# Altium project UG-003 Rev 3.PrjPcb (part 3 of 5)

## Sheet Sense Clock Ckt.SchDoc: Sense Clock Ckt
size OrCAD A; Engineer: Jack Walker; DocumentNumber: LM-003; Revision: 3; SheetNumber: 3; SheetTotal: 11
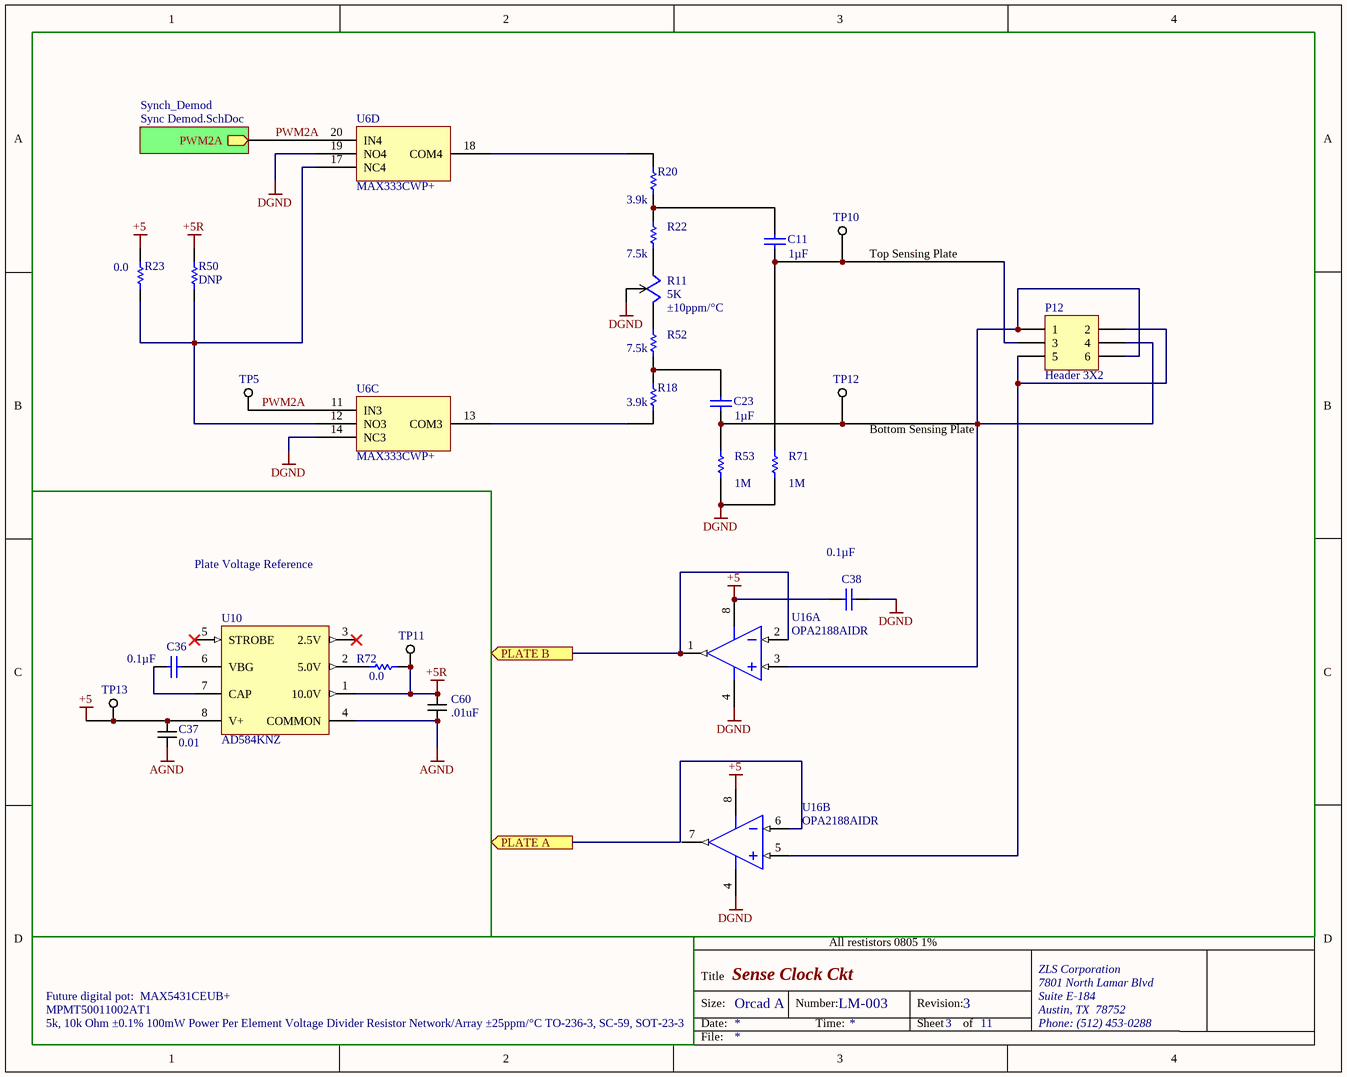
[diagram p2: Sense Clock Ckt.SchDoc]

### Parts
(Parts that share a designator on the sheet are numbered #1, #2 ... from top to bottom, then left to right.)
C11#2  Capacitance: 1µF  [CAPC0805(2012)155_L]  (hidden comment: CAP CER 1UF 25V X7R 0805)
C23  Capacitance: 1µF  [CAPC0805(2012)155_L]  (hidden comment: CAP CER 1UF 25V X7R 0805)
C36#1  Capacitance: 0.1µF  [CAPC0805(2012)100_N]  (hidden comment: CAP 100nF 25V 0805(2012))
C37#1  0.01  [RAD-0.1]
C38#1  Capacitance: 0.1µF  [CAPC0805(2012)155_L]  (hidden comment: CAP CER 0.1UF 25V X7R 0805)
C60  .01uF
P12#1  Header 3X2
R11  5K  Temperature Coefficient: ±10ppm/°C
R18  Resistance (Ohms): 3.9k  [RESC0805(2012)_N]  (hidden comment: RES SMD 3.9K OHM 5% 1/8W 0805)
R20  Resistance (Ohms): 3.9k  [RESC0805(2012)_N]  (hidden comment: RES SMD 3.9K OHM 5% 1/8W 0805)
R22  Resistance (Ohms): 7.5k  [RESC0805(2012)_N]  (hidden comment: RES SMD 7.5K OHM 1% 1/8W 0805)
R23  Resistance (Ohms): 0.0  [RESC0805(2012)_M]  (hidden comment: RES SMD 0.0 OHM JUMPER 1/8W 0805)
R50#1  DNP  [RESC0805(2012)_M]
R52#1  Resistance (Ohms): 7.5k  [RESC0805(2012)_N]  (hidden comment: RES SMD 7.5K OHM 1% 1/8W 0805)
R53#1  Resistance (Ohms): 1M  [RESC0805(2012)_N]  (hidden comment: RES SMD 1M OHM 1% 1/8W 0805)
R71  Resistance (Ohms): 1M  [RESC0805(2012)_N]  (hidden comment: RES SMD 1M OHM 1% 1/8W 0805)
R72  Resistance (Ohms): 0.0  [RESC0805(2012)_M]  (hidden comment: RES SMD 0.0 OHM JUMPER 1/8W 0805)
TP5  (no value)
TP10  (no value)
TP11  (no value)  [TESTPOINT .45]
TP12  (no value)
TP13  (no value)  [TESTPOINT .45]
U6#2  MAX333CWP+  (parts C,D of 4)
U10  AD584KNZ  [ADI-N-8]
U16#2  OPA2188AIDR  [D0008A_L]  (parts A,B of 2)

### Blocks framed on the sheet
Plate Voltage Reference: C36#1 C37#1 C60 R72 TP11 TP13 U10

### Sub-sheets
Synch_Demod = Sync Demod.SchDoc: PWM2A (out)

### Ports
PLATE A (out), PLATE B (out)

### Nets
+5: C37#1.1 C38#1.1 R23.2 TP13.1 U10.8(V+) U16#2.8(V+)
+5R: C60.1 R50#1.2 R72.1 TP11.1 U10.1(10.0V)
AGND: C37#1.2 C60.2 U10.4(COMMON)
DGND: C38#1.2 R11.3 R53#1.1 R71.1 U6#2.14(NC3) U6#2.19(NO4) U16#2.4(V-)
PWM2A: TP5.1 U6#2.11(IN3) U6#2.20(IN4) ; sheet Synch_Demod/PWM2A
NetC11#2_1: C11#2.1 P12#1.3 R71.2 TP10.1
NetC11#2_2: C11#2.2 R20.1 R22.2
NetC23_1: C23.1 P12#1.1 P12#1.4 P12#1.6 R53#1.2 TP12.1 U16#2.3(IN_A+)
NetC23_2: C23.2 R18.2 R52#1.1
NetC36#1_1: C36#1.1 U10.7(CAP)
NetC36#1_2: C36#1.2 U10.6(VBG)
NetP12#1_2: P12#1.2 P12#1.5 U16#2.5(IN_B+)
NetR11_1: R11.1 R22.1
NetR11_2: R11.2 R52#1.2
NetR18_1: R18.1 U6#2.13(COM3)
NetR20_2: R20.2 U6#2.18(COM4)
NetR23_1: R23.1 R50#1.1 U6#2.12(NO3) U6#2.17(NC4)
NetR72_2: R72.2 U10.2(5.0V)
NetU16#2_1: U16#2.1(OUT_A) U16#2.2(IN_A-) ; port PLATE B
NetU16#2_6: U16#2.6(IN_B-) ; port PLATE A

Not connected (* = marked no-connect by the designer): U6#2 15(N/C); U10 3(2.5V)* 5(STROBE)*; U16#2 7(OUT_B)

### Notes on the sheet
- (near TP10) Top Sensing Plate
- (near TP12) Bottom Sensing Plate
- All restistors 0805 1%
- MPMT50011002AT1
- 5k, 10k Ohm ±0.1% 100mW Power Per Element Voltage Divider Resistor Network/Array ±25ppm/°C TO-236-3, SC-59, SOT-23-3
- Future digital pot:  MAX5431CEUB+
- Title
- Size:
- Date:
- Orcad A
- Number:
- Time:
- Revision:
- Sheet
- of
- ZLS Corporation
- 7801 North Lamar Blvd
- Suite E-184
- Austin, TX  78752
- Phone: (512) 453-0288
- File:

### Library data of the parts
C11#2 C23 = CMP-1036-04882-1: Manufacturer: Murata Electronics North America; Manufacturer Part Number: GRM21BR71E105KA99L; Tolerance: ±10%; Supplier 1: Digi-Key; Supplier Part Number 1: 490-6484-6-ND; RoHS: RoHS Compliant; Description: CAP CER 1UF 25V X7R 0805; Category: Capacitors; Stock 1: 295074; Pricing 1: 1=0.14, 10=0.099, 100=0.0468, 500=0.0328, 1000=0.02715 (USD); Packaging: Digi-Reel®; Part Status: Active; Voltage - Rated: 25V; Temperature Coefficient: X7R; Operating Temperature: -55°C ~ 125°C; Features: -; Ratings: -; Applications: General Purpose; Mounting Type: Surface Mount, MLCC; Package / Case: 0805 (2012 Metric); Size / Dimension: 0.079" L x 0.049" W (2.00mm x 1.25mm); Height - Seated (Max): -; Thickness (Max): 0.053" (1.35mm); Lead Spacing: -; Lead Style: -; ComponentLink1URL: http://www.murata.com/~/media/webrenewal/support/library/catalog/products/capacitor/mlcc/c02e.ashx; ComponentLink1Description: http://www.murata.com/~/media/webrenewal/support/library/catalog/products/capacitor/mlcc/c02e.ashx
C36#1 = CMP-1036-04416-1: CAP 100nF 25V -20% to +80% 0805 (2012 Metric) Thickness 1mm SMD; Manufacturer: Murata Electronics North America; Manufacturer Part Number: GRM21BR71E104KA01L; Tolerance: ±10%; Temperature Coefficient: X7R; Supplier 1: Digi-Key; Supplier Part Number 1: 490-1673-1-ND; RoHS: RoHS Compliant; Category: Capacitors; Stock 1: 895391; Pricing 1: 1=0.2, 10=0.145, 100=0.0683, 500=0.04788, 1000=0.03964 (USD); Packaging: Cut Tape (CT); Part Status: Active; Voltage - Rated: 25V; Operating Temperature: -55°C ~ 125°C; Features: -; Ratings: -; Applications: General Purpose; Mounting Type: Surface Mount, MLCC; Package / Case: 0805 (2012 Metric); Size / Dimension: 0.079" L x 0.049" W (2.00mm x 1.25mm); Height - Seated (Max): -; Thickness (Max): 0.053" (1.35mm); Lead Spacing: -; Lead Style: -; ComponentLink1URL: http://www.murata.com/~/media/webrenewal/support/library/catalog/products/capacitor/mlcc/c02e.ashx; ComponentLink1Description: http://www.murata.com/~/media/webrenewal/support/library/catalog/products/capacitor/mlcc/c02e.ashx
C37#1 = CAP B: CAP CER 10000PF 50V 10% X7R 0402; Manufacturer 1: Murata Electronics North America; Manufacturer Part Number 1: GRM155R71H103KA88D; Category 1: Capacitors; Supplier 1: Digi-Key; Supplier Part Number 1: 490-4516-2-ND; RoHS 1: RoHS Compliant; Description 1: CAP CER 10000PF 50V 10% X7R 0402; Stock 1: 652600; Pricing 1: 10000=0.00372, 20000=0.00354, 30000=0.00336, 50000=0.00301, 100000=0.00243 (USD); Packaging: Tape & Reel (TR); Capacitance: 10000pF; Tolerance: ±10%; Voltage - Rated: 50V; Temperature Coefficient: X7R; Mounting Type: Surface Mount, MLCC; Operating Temperature: -55°C ~ 125°C; Applications: General Purpose; Ratings: -; Package / Case: 0402 (1005 Metric); Size / Dimension: 0.039" L x 0.020" W (1.00mm x 0.50mm); Height - Seated (Max): -; Thickness (Max): 0.022" (0.55mm); Lead Spacing: -; Features: -; Lead Style: -; ComponentLink1URL: http://www.murata.com/products/catalog/pdf/c02e.pdf; ComponentLink1Description: http://www.murata.com/products/catalog/pdf/c02e.pdf
C38#1 = CMP-1036-04882-1: Manufacturer: Murata Electronics North America; Manufacturer Part Number: GRM21BR71E104KA01L; Tolerance: ±10%; Supplier 1: Digi-Key; Supplier Part Number 1: 490-1673-6-ND; RoHS: RoHS Compliant; Description: CAP CER 0.1UF 25V X7R 0805; Category: Capacitors; Stock 1: 891652; Pricing 1: 1=0.2, 10=0.145, 100=0.0683, 500=0.04788, 1000=0.03964 (USD); Packaging: Digi-Reel®; Part Status: Active; Voltage - Rated: 25V; Temperature Coefficient: X7R; Operating Temperature: -55°C ~ 125°C; Features: -; Ratings: -; Applications: General Purpose; Mounting Type: Surface Mount, MLCC; Package / Case: 0805 (2012 Metric); Size / Dimension: 0.079" L x 0.049" W (2.00mm x 1.25mm); Height - Seated (Max): -; Thickness (Max): 0.053" (1.35mm); Lead Spacing: -; Lead Style: -; ComponentLink1URL: http://www.murata.com/~/media/webrenewal/support/library/catalog/products/capacitor/mlcc/c02e.ashx; ComponentLink1Description: http://www.murata.com/~/media/webrenewal/support/library/catalog/products/capacitor/mlcc/c02e.ashx
C60 = CAP B: CAP CER 10000PF 50V X7R 0805; Manufacturer 1: Murata Electronics North America; Manufacturer Part Number 1: GRM216R71H103KA01D; Category 1: Capacitors; Tolerance: ±10%; Supplier 1: Digi-Key; Supplier Part Number 1: 490-1664-1-ND; RoHS 1: RoHS Compliant; Description 1: CAP CER 10000PF 50V X7R 0805; Stock 1: 1003025; Pricing 1: 1=0.1, 10=0.072, 25=0.052, 50=0.0392, 100=0.032, 250=0.02672, 500=0.02282, 1000=0.01793 (USD); Packaging: Cut Tape (CT); Part Status: Active; Capacitance: 10000pF; Voltage - Rated: 50V; Temperature Coefficient: X7R; Operating Temperature: -55°C ~ 125°C; Features: -; Ratings: -; Applications: General Purpose; Mounting Type: Surface Mount, MLCC; Package / Case: 0805 (2012 Metric); Size / Dimension: 0.079" L x 0.049" W (2.00mm x 1.25mm); Height - Seated (Max): -; Thickness (Max): 0.028" (0.70mm); Lead Spacing: -; Lead Style: -; ComponentLink1URL: http://www.murata.com/~/media/webrenewal/support/library/catalog/products/capacitor/mlcc/c02e.ashx; ComponentLink1Description: http://www.murata.com/~/media/webrenewal/support/library/catalog/products/capacitor/mlcc/c02e.ashx
P12#1 = Header 3X2: Header, 3-Pin, Dual row; Manufacturer 1: Amphenol FCI; Manufacturer Part Number 1: 861400062YO2LF; Description 1: HEADER BERGSTIK; Category 1: Connectors, Interconnects; Pitch - Mating: 0.100" (2.54mm); Style: Board to Board or Cable; Shrouding: Unshrouded; Number of Positions: 6; Number of Positions Loaded: All; Contact Length - Mating: 0.276" (7.00mm); Contact Length - Post: 0.118" (3.00mm); Overall Contact Length: 0.496" (12.60mm); Material Flammability Rating: UL94 V-0; Current Rating: 3A; Voltage Rating: 1000V; Supplier 1: Digi-Key; Supplier Part Number 1: 861400062YO2LF-ND; RoHS 1: RoHS Compliant; Stock 1: 0; Pricing 1: 6000=0.09952 (USD); Packaging: Bulk; Part Status: Active; Connector Type: Header; Contact Type: Male Pin; Number of Rows: 2; Row Spacing - Mating: 0.100" (2.54mm); Mounting Type: Through Hole; Termination: Solder; Fastening Type: -; Insulation Height: 0.102" (2.60mm); Contact Shape: Square; Contact Finish - Mating: Gold or Gold, GXT™; Contact Finish Thickness - Mating: 8µin (0.20µm); Contact Finish - Post: -; Contact Material: Copper Alloy; Insulation Material: Thermoplastic; Features: -; Operating Temperature: -55°C ~ 125°C; Ingress Protection: -; Insulation Color: -; Mated Stacking Heights: -; Contact Finish Thickness - Post: -; Applications: -; ComponentLink1URL: http://portal.fciconnect.com/Comergent//fci/drawing/c-8614-0086.pdf; ComponentLink1Description: http://portal.fciconnect.com/Comergent//fci/drawing/c-8614-0086.pdf
R11 = RES1, CENTER TAP: TRIMMER 5K OHM 0.25W PC PIN; Manufacturer 1: Vishay Foil Resistors (Division of Vishay Precision Group); Manufacturer Part Number 1: Y00535K00000J0L; Category 1: Potentiometers, Variable Resistors; Power (Watts): 0.25W, 1/4W; Tolerance: ±5%; Number of Turns: 21; Adjustment Type: Side Adjustment; Resistive Material: Metal Foil; Supplier 1: Digi-Key; Supplier Part Number 1: 804-1020-ND; RoHS 1: RoHS Compliant; Description 1: TRIMMER 5K OHM 0.25W PC PIN; Stock 1: 679; Pricing 1: 1=34.42, 10=32.265, 25=26.5292, 50=22.944, 100=22.227, 250=20.793, 500=19.2156 (USD); Packaging: Bulk; Part Status: Active; Resistance (Ohms): 5k; Mounting Type: Through Hole; Termination Style: PC Pins; Size / Dimension: Rectangular - 0.250" x 0.175" Face x 0.250" L (6.35mm x 4.45mm x 6.35mm); ComponentLink1URL: http://www.vishaypg.com/docs/63053/1240.pdf; ComponentLink1Description: http://www.vishaypg.com/docs/63053/1240.pdf
R18 R20 = CMP-1013-00606-1: Manufacturer: Vishay Dale; Manufacturer Part Number: CRCW08053K90JNEA; Power (Watts): 0.125W, 1/8W; Temperature Coefficient: ±200ppm/°C; Supplier 1: Digi-Key; Supplier Part Number 1: 541-3.9KADKR-ND; RoHS: RoHS Compliant; Description: RES SMD 3.9K OHM 5% 1/8W 0805; Category: Resistors; Stock 1: 20963; Pricing 1: 1=0.1, 10=0.028, 100=0.0114, 1000=0.00513, 2500=0.00445 (USD); Packaging: Digi-Reel®; Part Status: Active; Tolerance: ±5%; Composition: Thick Film; Features: Automotive AEC-Q200; Operating Temperature: -55°C ~ 155°C; Package / Case: 0805 (2012 Metric); Supplier Device Package: 0805; Size / Dimension: 0.079" L x 0.049" W (2.00mm x 1.25mm); Height - Seated (Max): 0.020" (0.50mm); Failure Rate: -; ComponentLink1URL: http://www.vishay.com/docs/20035/dcrcwe3.pdf; ComponentLink1Description: http://www.vishay.com/docs/20035/dcrcwe3.pdf
R22 R52#1 = CMP-1013-00606-1: Manufacturer: Vishay Dale; Manufacturer Part Number: CRCW08057K50FKEA; Power (Watts): 0.125W, 1/8W; Temperature Coefficient: ±100ppm/°C; Supplier 1: Digi-Key; Supplier Part Number 1: 541-7.50KCDKR-ND; RoHS: RoHS Compliant; Category: Resistors; Stock 1: 0; Pricing 1: 1=0.1, 10=0.044, 100=0.0178, 1000=0.00802, 2500=0.00696 (USD); Packaging: Digi-Reel®; Part Status: Active; Tolerance: ±1%; Composition: Thick Film; Features: Automotive AEC-Q200; Operating Temperature: -55°C ~ 155°C; Package / Case: 0805 (2012 Metric); Supplier Device Package: 0805; Size / Dimension: 0.079" L x 0.049" W (2.00mm x 1.25mm); Height - Seated (Max): 0.020" (0.50mm); Failure Rate: -; ComponentLink1URL: http://www.vishay.com/docs/20035/dcrcwe3.pdf; ComponentLink1Description: http://www.vishay.com/docs/20035/dcrcwe3.pdf
R23 R72 = CMP-1013-00017-1: Manufacturer: Vishay Dale; Manufacturer Part Number: CRCW08050000Z0EA; Power (Watts): 0.125W, 1/8W; Supplier 1: Digi-Key; Supplier Part Number 1: 541-0.0ADKR-ND; RoHS: RoHS Compliant; Category: Resistors; Stock 1: 407603; Pricing 1: 1=0.1, 10=0.026, 25=0.0184, 50=0.014, 100=0.0104, 250=0.00792, 500=0.00634, 1000=0.00466 (USD); Packaging: Digi-Reel®; Part Status: Active; Tolerance: Jumper; Composition: Thick Film; Features: Automotive AEC-Q200; Temperature Coefficient: -; Operating Temperature: -55°C ~ 155°C; Package / Case: 0805 (2012 Metric); Supplier Device Package: 0805; Size / Dimension: 0.079" L x 0.049" W (2.00mm x 1.25mm); Height - Seated (Max): 0.020" (0.50mm); Failure Rate: -; ComponentLink1URL: http://www.vishay.com/docs/20035/dcrcwe3.pdf; ComponentLink1Description: http://www.vishay.com/docs/20035/dcrcwe3.pdf
R50#1 = CMP-1013-00017-1: RES SMD 0.0 OHM JUMPER 1/8W 0805; Manufacturer: Vishay Dale; Manufacturer Part Number: CRCW08050000Z0EA; Resistance (Ohms): 0.0; Power (Watts): 0.125W, 1/8W; Supplier 1: Digi-Key; Supplier Part Number 1: 541-0.0ADKR-ND; RoHS: RoHS Compliant; Category: Resistors; Stock 1: 407603; Pricing 1: 1=0.1, 10=0.026, 25=0.0184, 50=0.014, 100=0.0104, 250=0.00792, 500=0.00634, 1000=0.00466 (USD); Packaging: Digi-Reel®; Part Status: Active; Tolerance: Jumper; Composition: Thick Film; Features: Automotive AEC-Q200; Temperature Coefficient: -; Operating Temperature: -55°C ~ 155°C; Package / Case: 0805 (2012 Metric); Supplier Device Package: 0805; Size / Dimension: 0.079" L x 0.049" W (2.00mm x 1.25mm); Height - Seated (Max): 0.020" (0.50mm); Failure Rate: -; ComponentLink1URL: http://www.vishay.com/docs/20035/dcrcwe3.pdf; ComponentLink1Description: http://www.vishay.com/docs/20035/dcrcwe3.pdf
R53#1 R71 = CMP-1013-00606-1: Manufacturer: Vishay Dale; Manufacturer Part Number: CRCW08051M00FKEA; Power (Watts): 0.125W, 1/8W; Temperature Coefficient: ±100ppm/°C; Supplier 1: Digi-Key; Supplier Part Number 1: 541-1.00MCDKR-ND; RoHS: RoHS Compliant; Category: Resistors; Stock 1: 44065; Pricing 1: 1=0.1, 10=0.044, 100=0.0178, 1000=0.00802, 2500=0.00696 (USD); Packaging: Digi-Reel®; Part Status: Active; Tolerance: ±1%; Composition: Thick Film; Features: Automotive AEC-Q200; Operating Temperature: -55°C ~ 155°C; Package / Case: 0805 (2012 Metric); Supplier Device Package: 0805; Size / Dimension: 0.079" L x 0.049" W (2.00mm x 1.25mm); Height - Seated (Max): 0.020" (0.50mm); Failure Rate: -; ComponentLink1URL: http://www.vishay.com/docs/20035/dcrcwe3.pdf; ComponentLink1Description: http://www.vishay.com/docs/20035/dcrcwe3.pdf
TP5 TP10 TP12 = TESTPOINT A: TEST POINT PC MINI .040"D BLACK; Manufacturer 1: Keystone Electronics; Manufacturer Part Number 1: 5001; Category 1: Test and Measurement; Plating: Silver; Material - Insulation: Nylon 46, UL 94V-0; Material - Body: Phosphor Bronze; Supplier 1: Digi-Key; Supplier Part Number 1: 36-5001-ND; RoHS 1: RoHS Compliant; Description 1: TEST POINT PC MINI .040"D BLACK; Stock 1: 883882; Pricing 1: 1=0.37, 10=0.316, 50=0.2298, 100=0.2209, 250=0.19832, 500=0.18932, 1000=0.1616, 2500=0.14424, 5000=0.13523 (USD); Packaging: Bulk; Part Status: Active; Type: PC Test Point, Miniature; Mounting Type: 0.040" (1.02mm) Hole Diameter; Color: Black; Size / Dimension: 0.100" Dia x 0.180" L (2.54mm x 4.57mm); Height: -; ComponentLink1URL: http://www.keyelco.com/product-pdf.cfm?p=1310; ComponentLink1Description: http://www.keyelco.com/product-pdf.cfm?p=1310
TP11 TP13 = TESTPOINT A
U10 = CMP-0784-00054-1: Pin Programmable, Precision Voltage Reference, + 2.5 / + 5 / + 7.5 / + 10 Prog V Output, 4.5 to 30 V Supply, Commercial, 8-pin DIP (N-8), Tube; Manufacturer: Analog Devices; Max V Supply (V): 30; Min V Supply (V): 4.5; Ref Out TC (ppm/C): 15; Vout: 2.5V, 5V, 7.5V, 10V; ComponentLink3URL: http:/www.analog.com/static/imported-files/packages/PKG_PDF/PDIP(N)/N_8.pdf; ComponentLink1URL: http://www.analog.com/en/index.html; PartNumber: AD584KNZ; ComponentLink1Description: Manufacturer URL; ComponentLink2Description: Datasheet; PackageDescription: 8-Pin Plastic Dual In-Line Package, Row spacing 7.62 mm, Pitch 2.54 mm; Operating Temp Range: 0 to 70 degC; DatasheetVersion: Rev. C; Code_JEDEC: MS-001; Packing: Tube; ComponentLink3Description: Package Specification; PackageReference: N-8; ComponentLink4Description: URL Link1; Mounting Technology: Through Hole; PackageVersion: 070606-A, 07/2006; ComponentLink4URL: Product URL:http://www.analog.com/en/special-linear-functions/voltage-references/ad584/products/product.html; ComponentLink2URL: http://www.analog.com/static/imported-files/data_sheets/AD584.pdf
U16#2 = CMP-0272-00241-3: 0.03 uV/degC, 6 uV Vos, Low Noise, Rail-to-Rail Output, Zero-Drift Operational Amplifier, 4 to 36 V, -40 to 105 degC, 8-pin SOIC (D8), Green (RoHS & no Sb/Br); Manufacturer: Texas Instruments; Number of Circuits: 2; Slew Rate: 0.8 V/µs; Current - Supply: 415µA; Current - Output / Channel: 18mA; Voltage - Supply, Single/Dual (±): 4 V ~ 36 V, ±2 V ~ 18 V; Supplier 1: Digi-Key; Supplier Part Number 1: 296-29454-6-ND; Manufacturer Part Number: OPA2188AIDR; RoHS: RoHS Compliant; Category: Integrated Circuits (ICs); Stock 1: 8272; Pricing 1: 1=3.44, 10=3.089, 100=2.5307, 500=2.15434, 1000=1.81692 (USD); Packaging: Digi-Reel®; Part Status: Active; Amplifier Type: Zero-Drift; Output Type: Rail-to-Rail; -3db Bandwidth: -; Operating Temperature: -40°C ~ 105°C; Mounting Type: Surface Mount; Package / Case: 8-SOIC (0.154", 3.90mm Width); Supplier Device Package: 8-SOIC; ComponentLink1URL: http://www.ti.com/lit/ds/symlink/opa2188.pdf; ComponentLink1Description: http://www.ti.com/lit/ds/symlink/opa2188.pdf

## Sheet Sync Demod.SchDoc: Sync Demod
size OrCAD A; DocumentNumber: LM-003; Revision: 3.0; SheetNumber: 5; SheetTotal: 11
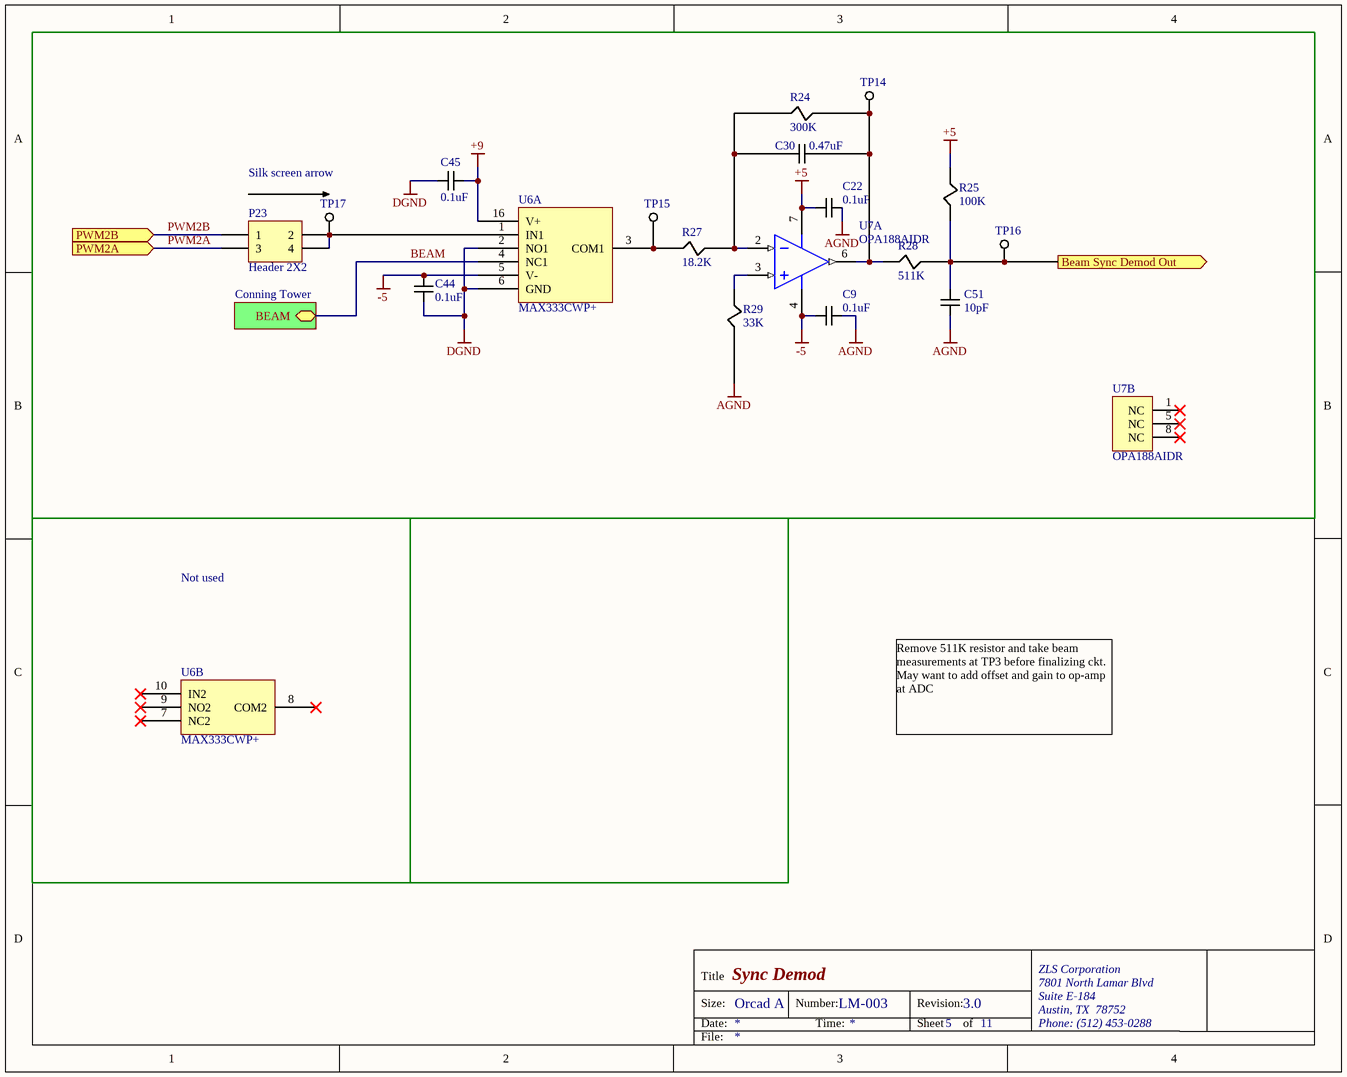
[diagram p3: Sync Demod.SchDoc]

### Parts
(Parts that share a designator on the sheet are numbered #1, #2 ... from top to bottom, then left to right.)
C9#2  0.1uF
C22  0.1uF
C30  0.47uF
C44#1  0.1uF
C45#1  0.1uF
C51  10pF
P23  Header 2X2  [HDR2X2]
R24  300K  [0805]
R25  100K  [0805]
R27  18.2K  [0805]
R28  511K  [0805]
R29  33K  [0805]
TP14  (no value)
TP15  (no value)
TP16  (no value)
TP17  (no value)
U6#2  MAX333CWP+  (parts A,B of 4)
U7#1  OPA188AIDR  [D0008A_M]  (part A of 2)
U7#2  OPA188AIDR  [D0008A_M]  (part B of 2)

### Blocks framed on the sheet
Silk screen arrow: C9#2 C22 C30 C44#1 C45#1 C51 P23 R24 R25 R27-R29 TP14-TP17 U6#2 U7#1 U7#2
Not used: U6#2

### Sub-sheets
Conning Tower = Connectors.SchDoc: BEAM

### Ports
Beam Sync Demod Out (out), PWM2A (in), PWM2B (in)

### Nets
+5: C22.1 R25.2 U7#1.7(V+)
+9: C45#1.2 U6#2.16(V+)
-5: C9#2.1 C44#1.1 U6#2.5(V-) U7#1.4(V-)
AGND: C9#2.2 C22.2 C51.2 R29.1
DGND: C44#1.2 C45#1.1 U6#2.2(NO1) U6#2.6(GND)
BEAM: U6#2.4(NC1) ; sheet Conning Tower/BEAM
PWM2A: P23.3 ; port PWM2A
PWM2B: P23.1 ; port PWM2B
NetC30_1: C30.1 R24.1 R27.2 U7#1.2(IN-)
NetC30_2: C30.2 R24.2 R28.1 TP14.1 U7#1.6(OUT)
NetC51_1: C51.1 R25.1 R28.2 TP16.1 ; port Beam Sync Demod Out
NetP23_2: P23.2 P23.4 TP17.1 U6#2.1(IN1)
NetR27_1: R27.1 TP15.1 U6#2.3(COM1)
NetR29_2: R29.2 U7#1.3(IN+)

Not connected (* = marked no-connect by the designer): U6#2 7(NC2)* 8(COM2)* 9(NO2)* 10(IN2)*; U7#2 1(NC)* 5(NC)* 8(NC)*

### Notes on the sheet
- Remove 511K resistor and take beam measurements at TP3 before finalizing ckt.
  May want to add offset and gain to op-amp at ADC
- Title
- Size:
- Date:
- Orcad A
- Number:
- Time:
- Revision:
- Sheet
- of
- ZLS Corporation
- 7801 North Lamar Blvd
- Suite E-184
- Austin, TX  78752
- Phone: (512) 453-0288
- File:

### Library data of the parts
C9#2 C22 C44#1 C45#1 = CAP B: CAP CER 0.1UF 25V X7R 0805; Manufacturer 1: Murata Electronics North America; Manufacturer Part Number 1: GRM21BR71E104KA01L; Category 1: Capacitors; Capacitance: 0.1µF; Tolerance: ±10%; Supplier 1: Digi-Key; Supplier Part Number 1: 490-1673-1-ND; RoHS 1: RoHS Compliant; Description 1: CAP CER 0.1UF 25V X7R 0805; Stock 1: 897437; Pricing 1: 1=0.2, 10=0.145, 25=0.106, 50=0.0824, 100=0.0683, 250=0.05652, 500=0.04788, 1000=0.03964 (USD); Packaging: Cut Tape (CT); Part Status: Active; Voltage - Rated: 25V; Temperature Coefficient: X7R; Operating Temperature: -55°C ~ 125°C; Features: -; Ratings: -; Applications: General Purpose; Mounting Type: Surface Mount, MLCC; Package / Case: 0805 (2012 Metric); Size / Dimension: 0.079" L x 0.049" W (2.00mm x 1.25mm); Height - Seated (Max): -; Thickness (Max): 0.053" (1.35mm); Lead Spacing: -; Lead Style: -; ComponentLink1URL: http://www.murata.com/~/media/webrenewal/support/library/catalog/products/capacitor/mlcc/c02e.ashx; ComponentLink1Description: http://www.murata.com/~/media/webrenewal/support/library/catalog/products/capacitor/mlcc/c02e.ashx
C30 = CAP B: CAP CER 0.47UF 25V X7R 0805; Manufacturer 1: Murata Electronics North America; Manufacturer Part Number 1: GRM219R71E474KA88D; Category 1: Capacitors; Capacitance: 0.47µF; Tolerance: ±10%; Supplier 1: Digi-Key; Supplier Part Number 1: 490-11584-1-ND; RoHS 1: RoHS Compliant; Description 1: CAP CER 0.47UF 25V X7R 0805; Stock 1: 32625; Pricing 1: 1=0.31, 10=0.219, 25=0.1792, 50=0.153, 100=0.1311, 250=0.10924, 500=0.09832, 1000=0.08303 (USD); Packaging: Cut Tape (CT); Part Status: Active; Voltage - Rated: 25V; Temperature Coefficient: X7R; Operating Temperature: -55°C ~ 125°C; Features: -; Ratings: -; Applications: General Purpose; Mounting Type: Surface Mount, MLCC; Package / Case: 0805 (2012 Metric); Size / Dimension: 0.079" L x 0.049" W (2.00mm x 1.25mm); Height - Seated (Max): -; Thickness (Max): 0.037" (0.95mm); Lead Spacing: -; Lead Style: -; ComponentLink1URL: http://www.murata.com/~/media/webrenewal/support/library/catalog/products/capacitor/mlcc/c02e.ashx; ComponentLink1Description: http://www.murata.com/~/media/webrenewal/support/library/catalog/products/capacitor/mlcc/c02e.ashx
C51 = CAP B: CAP CER 10PF 200V C0G/NP0 0805; Manufacturer 1: Murata Electronics North America; Manufacturer Part Number 1: GRM21A5C2D100JW01D; Category 1: Capacitors; Tolerance: ±5%; Temperature Coefficient: C0G, NP0; Supplier 1: Digi-Key; Supplier Part Number 1: 490-14649-1-ND; RoHS 1: RoHS Compliant; Description 1: CAP CER 10PF 200V C0G/NP0 0805; Stock 1: 1350; Pricing 1: 1=0.29, 10=0.196, 25=0.1436, 50=0.1174, 100=0.0991, 250=0.08084, 500=0.06782, 1000=0.05999 (USD); Part Status: Active; Capacitance: 10pF; Voltage - Rated: 200V; Operating Temperature: -55°C ~ 125°C; Features: -; Ratings: -; Applications: General Purpose; Failure Rate: -; Mounting Type: Surface Mount, MLCC; Package / Case: 0805 (2012 Metric); Size / Dimension: 0.079" L x 0.049" W (2.00mm x 1.25mm); Height - Seated (Max): -; Thickness (Max): 0.039" (1.00mm); Lead Spacing: -; Lead Style: -; ComponentLink1URL: http://search.murata.co.jp/Ceramy/image/img/A01X/G101/ENG/GRM21A5C2D100JW01-01.pdf; ComponentLink1Description: http://search.murata.co.jp/Ceramy/image/img/A01X/G101/ENG/GRM21A5C2D100JW01-01.pdf
P23 = Header 2X2: Header, 2-Pin, Dual row; Manufacturer 1: TE Connectivity AMP Connectors; Manufacturer Part Number 1: 1-87215-0; Description 1: CONN HEADER VERT 2POS .100 30AU; Category 1: Connectors, Interconnects; Style: Board to Board or Cable; Shrouding: Unshrouded; Number of Positions: 2; Number of Positions Loaded: All; Row Spacing - Mating: 0.100" (2.54mm); Contact Length - Mating: 0.318" (8.08mm); Contact Length - Post: 0.125" (3.18mm); Overall Contact Length: 0.533" (13.55mm); Material Flammability Rating: UL94 V-0; Current Rating: 3A; Supplier 1: Digi-Key; Supplier Part Number 1: A26564-ND; RoHS 1: RoHS Compliant; Stock 1: 9703; Pricing 1: 1=1.42, 10=1.287, 50=1.1554, 100=1.1029, 250=0.99784, 500=0.91906, 1000=0.78777, 2500=0.73525 (USD); Packaging: Bulk; Part Status: Active; Connector Type: Header; Contact Type: Male Pin; Pitch - Mating: -; Number of Rows: 2; Mounting Type: Through Hole; Termination: Solder; Fastening Type: Push-Pull; Insulation Height: 0.090" (2.29mm); Contact Shape: Circular; Contact Finish - Mating: Gold; Contact Finish Thickness - Mating: 30µin (0.76µm); Contact Finish - Post: Gold; Contact Material: Phosphor Bronze; Insulation Material: Thermoplastic; Features: -; Operating Temperature: -65°C ~ 105°C; Ingress Protection: -; Insulation Color: Black; Voltage Rating: -; Mated Stacking Heights: -; Contact Finish Thickness - Post: Flash; Applications: -; ComponentLink1URL: http://www.te.com/commerce/DocumentDelivery/DDEController?Action=srchrtrv&DocNm=87215&DocType=Customer+Drawing&DocLang=English; ComponentLink1Description: http://www.te.com/commerce/DocumentDelivery/DDEController?Action=srchrtrv&DocNm=87215&DocType=Customer+Drawing&DocLang=English
R24 = RES1: RES SMD 300K OHM 1% 1/8W 0805; Manufacturer 1: Vishay Dale; Manufacturer Part Number 1: CRCW0805300KFKEA; Category 1: Resistors; Power (Watts): 0.125W, 1/8W; Temperature Coefficient: ±100ppm/°C; Supplier 1: Digi-Key; Supplier Part Number 1: 541-300KCDKR-ND; RoHS 1: RoHS Compliant; Description 1: RES SMD 300K OHM 1% 1/8W 0805; Stock 1: 30792; Pricing 1: 1=0.1, 10=0.042, 25=0.0304, 50=0.0232, 100=0.017, 250=0.013, 500=0.0104, 1000=0.00765 (USD); Packaging: Digi-Reel®; Part Status: Active; Resistance (Ohms): 300k; Tolerance: ±1%; Composition: Thick Film; Features: Automotive AEC-Q200; Operating Temperature: -55°C ~ 155°C; Package / Case: 0805 (2012 Metric); Supplier Device Package: 0805; Size / Dimension: 0.079" L x 0.049" W (2.00mm x 1.25mm); Height - Seated (Max): 0.020" (0.50mm); Failure Rate: -; ComponentLink1URL: http://www.vishay.com/docs/20035/dcrcwe3.pdf; ComponentLink1Description: http://www.vishay.com/docs/20035/dcrcwe3.pdf
R25 = RES1: RES SMD 100K OHM 1% 1/8W 0805; Manufacturer 1: Vishay Dale; Manufacturer Part Number 1: CRCW0805100KFKEA; Category 1: Resistors; Power (Watts): 0.125W, 1/8W; Temperature Coefficient: ±100ppm/°C; Supplier 1: Digi-Key; Supplier Part Number 1: 541-100KCCT-ND; RoHS 1: RoHS Compliant; Description 1: RES SMD 100K OHM 1% 1/8W 0805; Stock 1: 231934; Pricing 1: 1=0.1, 10=0.042, 25=0.0304, 50=0.0232, 100=0.017, 250=0.013, 500=0.0104, 1000=0.00765 (USD); Packaging: Cut Tape (CT); Part Status: Active; Resistance (Ohms): 100k; Tolerance: ±1%; Composition: Thick Film; Features: Automotive AEC-Q200; Operating Temperature: -55°C ~ 155°C; Package / Case: 0805 (2012 Metric); Supplier Device Package: 0805; Size / Dimension: 0.079" L x 0.049" W (2.00mm x 1.25mm); Height - Seated (Max): 0.020" (0.50mm); Failure Rate: -; ComponentLink1URL: http://www.vishay.com/docs/20035/dcrcwe3.pdf; ComponentLink1Description: http://www.vishay.com/docs/20035/dcrcwe3.pdf
R27 = RES1: RES SMD 18.2K OHM 1% 1/8W 0805; Manufacturer 1: Vishay Dale; Manufacturer Part Number 1: CRCW080518K2FKEA; Category 1: Resistors; Power (Watts): 0.125W, 1/8W; Temperature Coefficient: ±100ppm/°C; Supplier 1: Digi-Key; Supplier Part Number 1: 541-18.2KCCT-ND; RoHS 1: RoHS Compliant; Description 1: RES SMD 18.2K OHM 1% 1/8W 0805; Stock 1: 1350; Pricing 1: 1=0.1, 10=0.042, 25=0.0304, 50=0.0232, 100=0.017, 250=0.013, 500=0.0104, 1000=0.00765 (USD); Packaging: Cut Tape (CT); Part Status: Active; Resistance (Ohms): 18.2k; Tolerance: ±1%; Composition: Thick Film; Features: Automotive AEC-Q200; Operating Temperature: -55°C ~ 155°C; Package / Case: 0805 (2012 Metric); Supplier Device Package: 0805; Size / Dimension: 0.079" L x 0.049" W (2.00mm x 1.25mm); Height - Seated (Max): 0.020" (0.50mm); Failure Rate: -; ComponentLink1URL: http://www.vishay.com/docs/20035/dcrcwe3.pdf; ComponentLink1Description: http://www.vishay.com/docs/20035/dcrcwe3.pdf
R28 = RES1: RES SMD 511K OHM 1% 1/8W 0805; Manufacturer 1: Vishay Dale; Manufacturer Part Number 1: CRCW0805511KFKEA; Category 1: Resistors; Power (Watts): 0.125W, 1/8W; Temperature Coefficient: ±100ppm/°C; Supplier 1: Digi-Key; Supplier Part Number 1: 541-511KCCT-ND; RoHS 1: RoHS Compliant; Description 1: RES SMD 511K OHM 1% 1/8W 0805; Stock 1: 7865; Pricing 1: 1=0.1, 10=0.042, 25=0.0304, 50=0.0232, 100=0.017, 250=0.013, 500=0.0104, 1000=0.00765 (USD); Packaging: Cut Tape (CT); Part Status: Active; Resistance (Ohms): 511k; Tolerance: ±1%; Composition: Thick Film; Features: Automotive AEC-Q200; Operating Temperature: -55°C ~ 155°C; Package / Case: 0805 (2012 Metric); Supplier Device Package: 0805; Size / Dimension: 0.079" L x 0.049" W (2.00mm x 1.25mm); Height - Seated (Max): 0.020" (0.50mm); Failure Rate: -; ComponentLink1URL: http://www.vishay.com/docs/20035/dcrcwe3.pdf; ComponentLink1Description: http://www.vishay.com/docs/20035/dcrcwe3.pdf
R29 = RES1: RES SMD 33K OHM 1% 1/8W 0805; Manufacturer 1: Vishay Dale; Manufacturer Part Number 1: CRCW080533K0FKEA; Category 1: Resistors; Power (Watts): 0.125W, 1/8W; Temperature Coefficient: ±100ppm/°C; Supplier 1: Digi-Key; Supplier Part Number 1: 541-33.0KCDKR-ND; RoHS 1: RoHS Compliant; Description 1: RES SMD 33K OHM 1% 1/8W 0805; Stock 1: 24473; Pricing 1: 1=0.1, 10=0.042, 25=0.0304, 50=0.0232, 100=0.017, 250=0.013, 500=0.0104, 1000=0.00765 (USD); Packaging: Digi-Reel®; Part Status: Active; Resistance (Ohms): 33k; Tolerance: ±1%; Composition: Thick Film; Features: Automotive AEC-Q200; Operating Temperature: -55°C ~ 155°C; Package / Case: 0805 (2012 Metric); Supplier Device Package: 0805; Size / Dimension: 0.079" L x 0.049" W (2.00mm x 1.25mm); Height - Seated (Max): 0.020" (0.50mm); Failure Rate: -; ComponentLink1URL: http://www.vishay.com/docs/20035/dcrcwe3.pdf; ComponentLink1Description: http://www.vishay.com/docs/20035/dcrcwe3.pdf
TP14-TP17 = TESTPOINT A: as TP5 on sheet Sense Clock Ckt; Supplier 1: Digi-Key; Supplier Part Number 1: 36-5001-ND; RoHS 1: RoHS Compliant; Description 1: TEST POINT PC MINI .040"D BLACK; Stock 1: 883882; Pricing 1: 1=0.37, 10=0.316, 50=0.2298, 100=0.2209, 250=0.19832, 500=0.18932, 1000=0.1616, 2500=0.14424, 5000=0.13523 (USD); Packaging: Bulk; Part Status: Active; Type: PC Test Point, Miniature; Mounting Type: 0.040" (1.02mm) Hole Diameter; Color: Black; Size / Dimension: 0.100" Dia x 0.180" L (2.54mm x 4.57mm); Height: -; ComponentLink1URL: http://www.keyelco.com/product-pdf.cfm?p=1310; ComponentLink1Description: http://www.keyelco.com/product-pdf.cfm?p=1310
U7#1 U7#2 = CMP-0809-00004-2: Precision, Low Noise, Rail-to-Rail Output, Zero-Drift Operational Amplifier, 4 to 36 V, -40 to 125 degC, 8-pin SOIC (D8), Green (RoHS & no Sb/Br); Manufacturer: Texas Instruments; Iq per channel(Max)(mA): 0.51; SubFamily: Zero Drift Precision Amplifier; Total Supply Voltage(Max)(+5V is 5, +/-5V is 10): 36; CMRR(Min)(dB): 120; Total Supply Voltage(Min)(+5V is 5, +/-5V is 10): 4; Slew Rate(Typ)(V/us): 0.8; GBW(Typ)(MHz): 2; Offset Drift(Typ)(uV/C): 0.03; Number of Channels: 1; Rating: Catalog; Packing: LARGE T&R; ComponentLink2URL: http://www.ti.com/lit/ds/symlink/opa188.pdf; Eco-Plan: Green (RoHS & no Sb/Br); DatasheetVersion: SBOS642A; PartNumber: OPA188AIDR; ComponentLink3Description: Package Specification; PackageDescription: 8-Pin Plastic Small Outline, Body 4.9 x 3.9 mm, Pitch 1.27 mm; Code_JEDEC: MS-012; ComponentLink1Description: Manufacturer URL; PackageReference: D0008A; Mounting Technology: Surface Mount; PackageVersion: 4040047-3/M, 06/2011; ComponentLink3URL: http://www.ti.com/litv/pdf/msoi002j; ComponentLink2Description: Datasheet; ComponentLink1URL: http://www.ti.com/; PartId: 1

## Sheet Connectors.SchDoc: Connectors
size OrCAD A; DocumentNumber: LM-003; Revision: 3.0; SheetNumber: 5; SheetTotal: 11
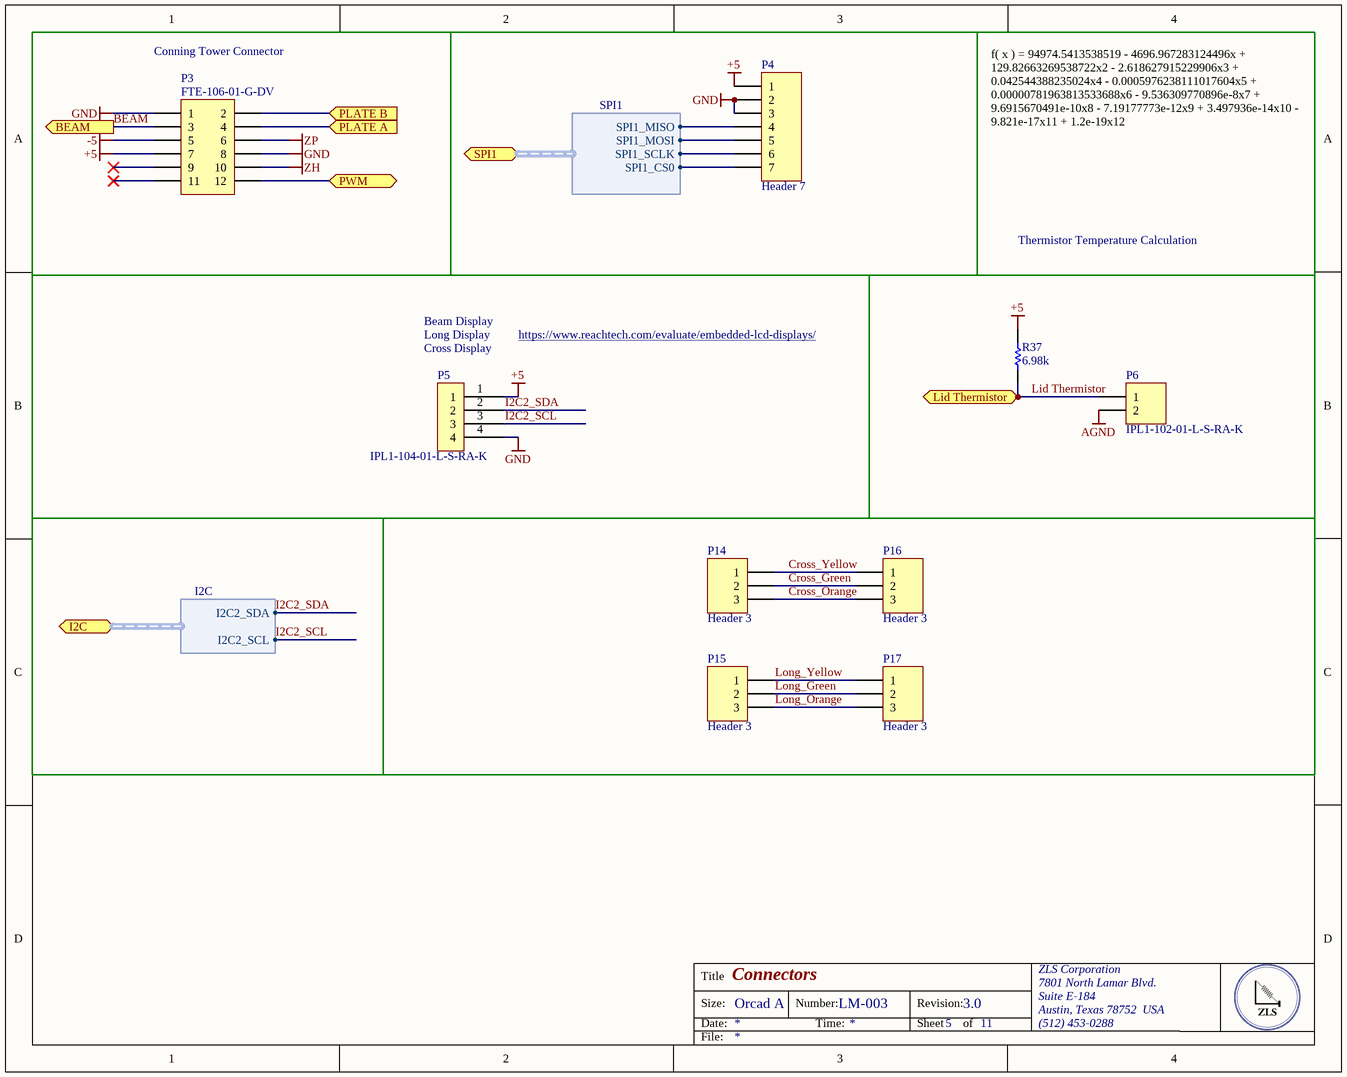
[diagram p4: Connectors.SchDoc]

### Parts
P3  FTE-106-01-G-DV  [FTSH-106-01]
P4  Header 7  [HDR1X7]
P5  IPL1-104-01-L-S-RA-K  [IPL1-104-01]
P6  IPL1-102-01-L-S-RA-K  [IPL1-102-01]
P14  Header 3  [HDR1X3]
P15  Header 3  [HDR1X3]
P16  Header 3  [TLW-103-01-G-S-RA]
P17  Header 3  [TLW-103-01-G-S-RA]
R37  Resistance (Ohms): 6.98k  [RESC0805(2012)_N]  (hidden comment: 6K98 1% 0805(2012))

### Blocks framed on the sheet
Conning Tower Connector: P3

### Ports
BEAM (out), I2C (harness I2C), Lid Thermistor, PLATE A (in), PLATE B (in), PWM, SPI1 (harness SPI1)

### Harnesses
I2C: I2C2_SDA, I2C2_SCL
SPI1: SPI1_CS0, SPI1_MISO, SPI1_MOSI, SPI1_SCLK

### Nets
+5: P3.7 P4.1 P5.1 R37.2
-5: P3.5
AGND: P6.2
GND: P3.1 P3.8 P4.2 P4.3 P5.4
ZH: P3.10
ZP: P3.6
BEAM: P3.3 ; port BEAM
Cross_Green: P14.2 P16.2
Cross_Orange: P14.3 P16.3
Cross_Yellow: P14.1 P16.1
I2C2_SCL: P5.3 ; port I2C.I2C2_SCL
I2C2_SDA: P5.2 ; port I2C.I2C2_SDA
Lid Thermistor: P6.1 R37.1 ; port Lid Thermistor
Long_Green: P15.2 P17.2
Long_Orange: P15.3 P17.3
Long_Yellow: P15.1 P17.1
NetP3_2: P3.2 ; port PLATE B
NetP3_4: P3.4 ; port PLATE A
NetP3_12: P3.12 ; port PWM
NetP4_4: P4.4 ; port SPI1.SPI1_MISO
NetP4_5: P4.5 ; port SPI1.SPI1_MOSI
NetP4_6: P4.6 ; port SPI1.SPI1_SCLK
NetP4_7: P4.7 ; port SPI1.SPI1_CS0

Not connected (* = marked no-connect by the designer): P3 9* 11*

### Notes on the sheet
- f( x ) = 94974.5413538519 - 4696.967283124496x + 129.82663269538722x2 - 2.618627915229906x3 + 0.042544388235024x4 - 0.0005976238111017604x5 + 0.00000781963813533688x6 - 9.536309770896e-8x7 + 9.6915670491e-10x8 - 7.19177773e-12x9 + 3.497936e-14x10 - 9.821e-17x11 + 1.2e-19x12
- Thermistor Temperature Calculation
- (near P5) Cross Display
- Long Display
- Beam Display
- https://www.reachtech.com/evaluate/embedded-lcd-displays/
- Title
- Size:
- Date:
- Orcad A
- Number:
- Time:
- Revision:
- Sheet
- of
- ZLS Corporation
- 7801 North Lamar Blvd.
- Suite E-184
- Austin, Texas 78752  USA
- (512) 453-0288
- File:

### Library data of the parts
P3 = Header 6X2: Header, 6-Pin, Dual row; Manufacturer: Samtec; Connector Type: Male Header; No. of positions: 6; No. of Rows: 2; Pitch: 0.8mm; Number of Positions: 12; Number of Positions Loaded: All; Row Spacing: 0.047" (1.20mm); Molding Height Above Board: 0.067" (1.70mm); Pitch Spacing: 0.8; Contact Termination: Surface Mount Vertical; LatestRevisionDate: 17-Jul-2002; LatestRevisionNote: Re-released for DXP Platform.; Publisher: Altium Limited; Supplier 1: Newark; ComponentLink1URL: http://www.samtec.com/; ComponentLink2URL: http://www.samtec.com/technical-specifications/Default.aspx?SeriesMaster=FTE; Mounting Technology: Surface Mount; Supplier 2: Digi-Key; Manufacturer Part Number: FTE-106-01-G-DV; RoHS: RoHS Compliant; Category: Connectors, Interconnects; Stock 2: 0; Pricing 2: 1=7.49, 10=6.49, 100=5.4911, 500=4.36794, 1000=3.55676, 5000=3.24476, 10000=3.11996 (USD); Packaging: Tube; Number of Rows: 2; Height Stacking (Mating): -; Contact Mating Length: 0.075" (1.90mm); Mounting Type: Surface Mount; Termination: Solder; Contact Finish: Gold; Contact Finish Thickness: 10µin (0.25µm); Features: -; Color: Black; ComponentLink3URL: http://www.samtec.com/documents/webfiles/pdf/FTE_SM.PDF; ComponentLink3Description: http://www.samtec.com/documents/webfiles/pdf/FTE_SM.PDF; Stock 1: 0; Pricing 1: 1=3.26, 10=2.85, 100=2.43, 500=2, 1000=1.72, 5000=1.55, 10000=1.48 (USD); Series: FTE; No. of Contacts: 12; Gender: Header; Contact Plating: Gold; Contact Material: Phosphor Bronze; ComponentLink4URL: http://www.samtec.com/ftppub/pdf/FTE_SM.PDF; ComponentLink4Description: http://www.samtec.com/ftppub/pdf/FTE_SM.PDF; Supplier Part Number 1: 11P4479; Supplier Part Number 2: SAM1144-06-ND
P4 = Header 7: Header, 7-Pin; LatestRevisionDate: 17-Jul-2002; LatestRevisionNote: Re-released for DXP Platform.; Publisher: Altium Limited
P5 = 53047-0410: .100 TERMINAL ASSY; Manufacturer 1: Samtec Inc.; Category 1: Connectors, Interconnects; Connector Type: Header; Pitch - Mating: 0.100" (2.54mm); Style: Board to Cable/Wire; Shrouding: Shrouded - 4 Wall; Number of Positions: 4; Number of Positions Loaded: All; Contact Length - Mating: 0.215" (5.46mm); Contact Length - Post: 0.085" (2.16mm); Material Flammability Rating: UL94 V-0; Voltage Rating: 675VAC, 954VDC; Supplier 1: Digi-Key; Supplier Part Number 1: SAM9597-ND; Manufacturer Part Number 1: IPL1-104-01-L-S-RA-K; RoHS 1: RoHS Compliant; Description 1: .100 TERMINAL ASSY; Stock 1: 100; Pricing 1: 1=2.53, 10=2.424, 25=2.222, 50=2.121, 100=2.02, 250=1.76752, 500=1.717, 1000=1.4645, 2500=1.3635 (USD); Packaging: Tube; Part Status: Active; Contact Type: Male Pin; Number of Rows: 1; Row Spacing - Mating: -; Mounting Type: Through Hole, Right Angle; Termination: Solder; Fastening Type: Locking Ramp; Overall Contact Length: -; Insulation Height: 0.240" (6.10mm); Contact Shape: Square; Contact Finish - Mating: Gold; Contact Finish Thickness - Mating: 10µin (0.25µm); Contact Finish - Post: Tin; Contact Material: Phosphor Bronze; Insulation Material: Liquid Crystal Polymer (LCP); Features: -; Operating Temperature: -55°C ~ 125°C; Ingress Protection: -; Insulation Color: Natural; Current Rating: -; Mated Stacking Heights: -; Contact Finish Thickness - Post: -; Applications: -; ComponentLink1URL: http://suddendocs.samtec.com/prints/ipl1-1xx-xx-xxx-s-xx-x-xx-mkt.pdf; ComponentLink1Description: http://suddendocs.samtec.com/prints/ipl1-1xx-xx-xxx-s-xx-x-xx-mkt.pdf
P6 = Header 2H: CONN SHROUDED PWR HEADER 2POS; Manufacturer 1: Samtec Inc.; Category 1: Connectors, Interconnects; Pitch - Mating: 0.100" (2.54mm); Style: Board to Cable/Wire; Shrouding: Shrouded - 4 Wall; Number of Positions: 2; Number of Positions Loaded: All; Contact Length - Mating: 0.215" (5.46mm); Contact Length - Post: 0.085" (2.16mm); Material Flammability Rating: UL94 V-0; Voltage Rating: 675VAC, 954VDC; Supplier 1: Digi-Key; Supplier Part Number 1: SAM10566-ND; Manufacturer Part Number 1: IPL1-102-01-L-S-RA-K; RoHS 1: RoHS Compliant; Description 1: CONN SHROUDED PWR HEADER 2POS; Stock 1: 0; Pricing 1: 1=2.44, 10=2.217, 25=2.0816, 50=1.991, 100=1.9005, 250=1.71952, 500=1.58376, 1000=1.3575, 2500=1.267 (USD); Packaging: Tube; Part Status: Active; Connector Type: Header; Contact Type: Male Pin; Number of Rows: 1; Row Spacing - Mating: -; Mounting Type: Through Hole, Right Angle; Termination: Solder; Fastening Type: Locking Ramp; Overall Contact Length: -; Insulation Height: 0.240" (6.10mm); Contact Shape: Square; Contact Finish - Mating: Gold; Contact Finish Thickness - Mating: 10µin (0.25µm); Contact Finish - Post: Tin; Contact Material: Phosphor Bronze; Insulation Material: Liquid Crystal Polymer (LCP); Features: -; Operating Temperature: -55°C ~ 125°C; Ingress Protection: -; Insulation Color: Natural; Current Rating: -; Mated Stacking Heights: -; Contact Finish Thickness - Post: -; Applications: -; ComponentLink1URL: http://suddendocs.samtec.com/prints/ipl1-1xx-xx-xxx-s-xx-x-xx-mkt.pdf; ComponentLink1Description: http://suddendocs.samtec.com/prints/ipl1-1xx-xx-xxx-s-xx-x-xx-mkt.pdf
P14-P17 = Header 3: Header, 3-Pin; LatestRevisionDate: 17-Jul-2002; LatestRevisionNote: Re-released for DXP Platform.; Publisher: Altium Limited
R37 = CMP-1013-00606-1: 6K98 0.125W 1% 0805 (2012 Metric)  SMD; Manufacturer: Vishay Dale; Manufacturer Part Number: CRCW08056K98FKEA; Power (Watts): 0.125W, 1/8W; Temperature Coefficient: ±100ppm/°C; Supplier 1: Digi-Key; Supplier Part Number 1: 541-6.98KCCT-ND; RoHS: RoHS Compliant; Category: Resistors; Stock 1: 34245; Pricing 1: 1=0.1, 10=0.044, 100=0.0178, 1000=0.00802, 2500=0.00696 (USD); Packaging: Cut Tape (CT); Part Status: Active; Tolerance: ±1%; Composition: Thick Film; Features: Automotive AEC-Q200; Operating Temperature: -55°C ~ 155°C; Package / Case: 0805 (2012 Metric); Supplier Device Package: 0805; Size / Dimension: 0.079" L x 0.049" W (2.00mm x 1.25mm); Height - Seated (Max): 0.020" (0.50mm); Failure Rate: -; ComponentLink1URL: http://www.vishay.com/docs/20035/dcrcwe3.pdf; ComponentLink1Description: http://www.vishay.com/docs/20035/dcrcwe3.pdf

## Sheet PWM.SchDoc: PWM
size OrCAD A; DocumentNumber: LM-003; Revision: 3.0; SheetNumber: 4; SheetTotal: 11
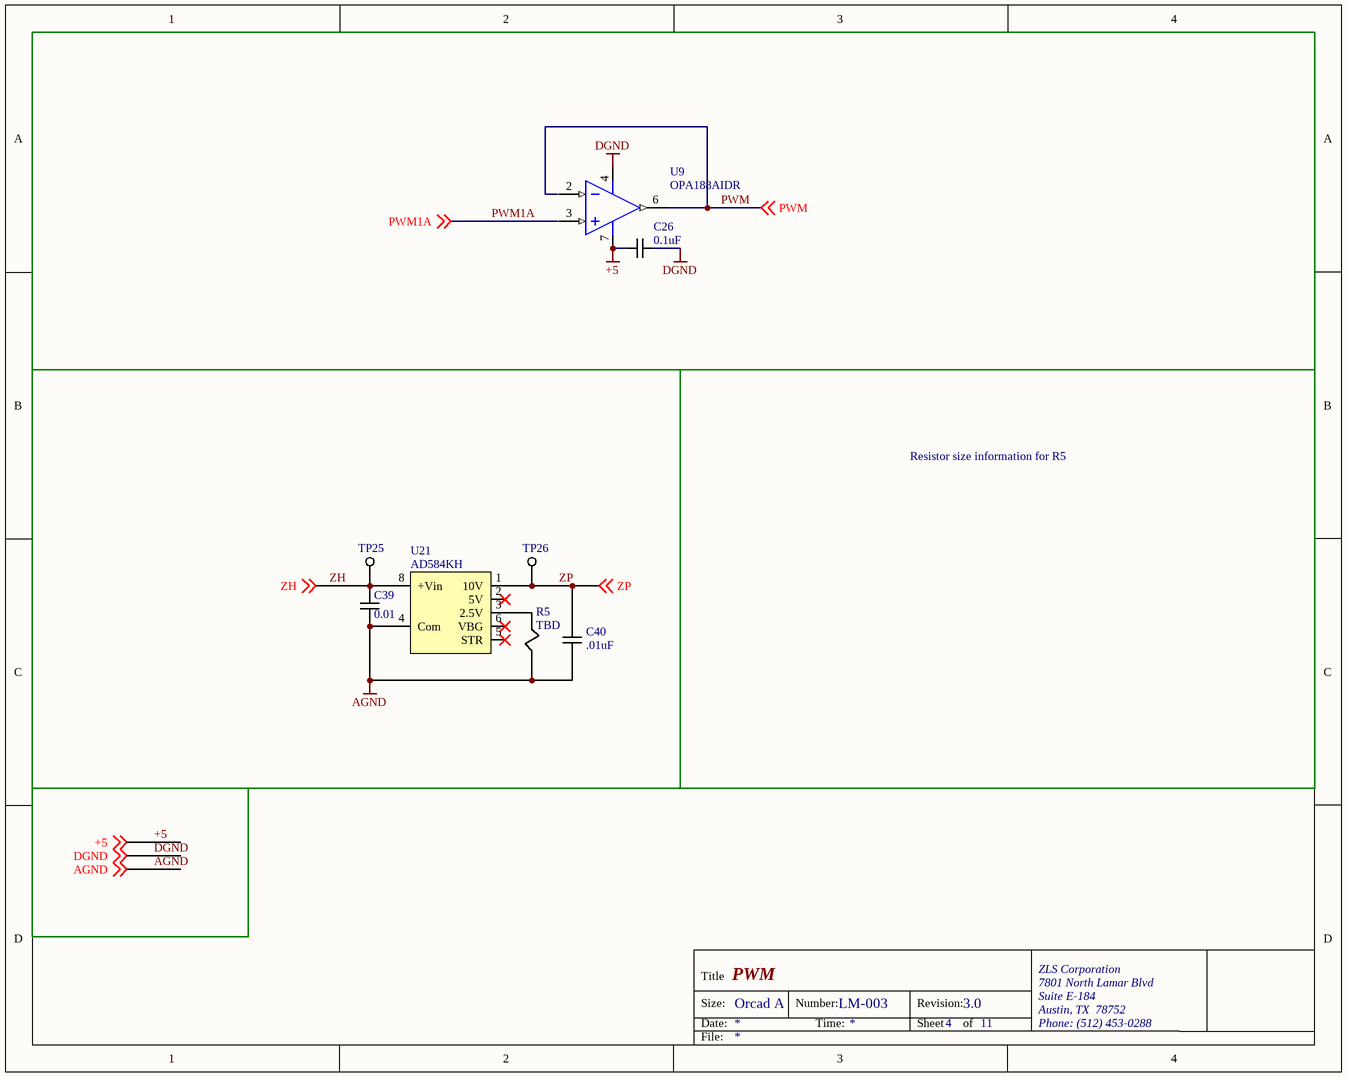
[diagram p5: PWM.SchDoc]

### Parts
(Parts that share a designator on the sheet are numbered #1, #2 ... from top to bottom, then left to right.)
C26  0.1uF
C39#1  0.01  [RAD-0.1]
C40#1  .01uF
R5#2  TBD
TP25  (no value)  [TESTPOINT .45]
TP26  (no value)
U9  OPA188AIDR
U21  AD584KH

### Nets
+5: C26.1 U9.7(+VS) ; off-sheet +5
AGND: C39#1.2 C40#1.2 R5#2.1 U21.4(Com) ; off-sheet AGND
DGND: C26.2 U9.4(-VS) ; off-sheet DGND
PWM: U9.6(-IN) ; off-sheet PWM
PWM1A: off-sheet PWM1A
ZH: C39#1.1 TP25.1 U21.8(+Vin) ; off-sheet ZH
ZP: C40#1.1 TP26.1 U21.1(10V) ; off-sheet ZP
NetR5#2_2: R5#2.2 U21.3(2.5V)

Not connected (* = marked no-connect by the designer): U9 2(-IN_A) 3(+IN_A); U21 2(5V)* 5(STR)* 6(VBG)*

### Notes on the sheet
- Resistor size information for R5
- Title
- Size:
- Date:
- Orcad A
- Number:
- Time:
- Revision:
- Sheet
- of
- ZLS Corporation
- 7801 North Lamar Blvd
- Suite E-184
- Austin, TX  78752
- Phone: (512) 453-0288
- File:

### Library data of the parts
C26 = CAP B: as C9#2 on sheet Sync Demod; Supplier 1: Digi-Key; Supplier Part Number 1: 490-1673-1-ND; RoHS 1: RoHS Compliant; Description 1: CAP CER 0.1UF 25V X7R 0805; Stock 1: 897437; Pricing 1: 1=0.2, 10=0.145, 25=0.106, 50=0.0824, 100=0.0683, 250=0.05652, 500=0.04788, 1000=0.03964 (USD); Packaging: Cut Tape (CT); Part Status: Active; Voltage - Rated: 25V; Temperature Coefficient: X7R; Operating Temperature: -55°C ~ 125°C; Features: -; Ratings: -; Applications: General Purpose; Mounting Type: Surface Mount, MLCC; Package / Case: 0805 (2012 Metric); Size / Dimension: 0.079" L x 0.049" W (2.00mm x 1.25mm); Height - Seated (Max): -; Thickness (Max): 0.053" (1.35mm); Lead Spacing: -; Lead Style: -; ComponentLink1URL: http://www.murata.com/~/media/webrenewal/support/library/catalog/products/capacitor/mlcc/c02e.ashx; ComponentLink1Description: http://www.murata.com/~/media/webrenewal/support/library/catalog/products/capacitor/mlcc/c02e.ashx
C39#1 = CAP B: as C37#1 on sheet Sense Clock Ckt; Supplier 1: Digi-Key; Supplier Part Number 1: 490-4516-2-ND; RoHS 1: RoHS Compliant; Description 1: CAP CER 10000PF 50V 10% X7R 0402; Stock 1: 652600; Pricing 1: 10000=0.00372, 20000=0.00354, 30000=0.00336, 50000=0.00301, 100000=0.00243 (USD); Packaging: Tape & Reel (TR); Capacitance: 10000pF; Tolerance: ±10%; Voltage - Rated: 50V; Temperature Coefficient: X7R; Mounting Type: Surface Mount, MLCC; Operating Temperature: -55°C ~ 125°C; Applications: General Purpose; Ratings: -; Package / Case: 0402 (1005 Metric); Size / Dimension: 0.039" L x 0.020" W (1.00mm x 0.50mm); Height - Seated (Max): -; Thickness (Max): 0.022" (0.55mm); Lead Spacing: -; Features: -; Lead Style: -; ComponentLink1URL: http://www.murata.com/products/catalog/pdf/c02e.pdf; ComponentLink1Description: http://www.murata.com/products/catalog/pdf/c02e.pdf
C40#1 = CAP B: as C60 on sheet Sense Clock Ckt; Supplier 1: Digi-Key; Supplier Part Number 1: 490-1664-1-ND; RoHS 1: RoHS Compliant; Description 1: CAP CER 10000PF 50V X7R 0805; Stock 1: 1003025; Pricing 1: 1=0.1, 10=0.072, 25=0.052, 50=0.0392, 100=0.032, 250=0.02672, 500=0.02282, 1000=0.01793 (USD); Packaging: Cut Tape (CT); Part Status: Active; Capacitance: 10000pF; Voltage - Rated: 50V; Temperature Coefficient: X7R; Operating Temperature: -55°C ~ 125°C; Features: -; Ratings: -; Applications: General Purpose; Mounting Type: Surface Mount, MLCC; Package / Case: 0805 (2012 Metric); Size / Dimension: 0.079" L x 0.049" W (2.00mm x 1.25mm); Height - Seated (Max): -; Thickness (Max): 0.028" (0.70mm); Lead Spacing: -; Lead Style: -; ComponentLink1URL: http://www.murata.com/~/media/webrenewal/support/library/catalog/products/capacitor/mlcc/c02e.ashx; ComponentLink1Description: http://www.murata.com/~/media/webrenewal/support/library/catalog/products/capacitor/mlcc/c02e.ashx
R5#2 = RES1: RES TBD OHM 0.3W 1% RADIAL; Category 1: Resistors; Description 1: RES TBD OHM 0.3W 1% RADIAL; ComponentLink1URL: http://www.vishaypg.com/docs/63004/vh.pdf
TP25 = TESTPOINT A
TP26 = TESTPOINT A: as TP5 on sheet Sense Clock Ckt; Supplier 1: Digi-Key; Supplier Part Number 1: 36-5001-ND; RoHS 1: RoHS Compliant; Description 1: TEST POINT PC MINI .040"D BLACK; Stock 1: 883882; Pricing 1: 1=0.37, 10=0.316, 50=0.2298, 100=0.2209, 250=0.19832, 500=0.18932, 1000=0.1616, 2500=0.14424, 5000=0.13523 (USD); Packaging: Bulk; Part Status: Active; Type: PC Test Point, Miniature; Mounting Type: 0.040" (1.02mm) Hole Diameter; Color: Black; Size / Dimension: 0.100" Dia x 0.180" L (2.54mm x 4.57mm); Height: -; ComponentLink1URL: http://www.keyelco.com/product-pdf.cfm?p=1310; ComponentLink1Description: http://www.keyelco.com/product-pdf.cfm?p=1310
U9 = OPA188AIDR: Manufacturer 1: Texas Instruments; Description 1: Precision Amplifiers Prec,Low Noise,RRO 36V 0-Drift Op Amp; Manufacturer Part Number 1: OPA188AIDR; ComponentLinkURL: http://www.ti.com/lit/ds/symlink/opa188.pdf; Package/ Case: SOIC-8; Packaging: Reel; Supplier 1: Mouser; Supplier Part Number 1: 595-OPA188AIDR
U21 = VOLTAGE REF, AD584KH: IC VREF SERIES PROG TO99-8; Manufacturer 1: Analog Devices Inc.; Category 1: Integrated Circuits (ICs); Output Type: Programmable; Voltage - Output (Min/Fixed): 2.5V, 5V, 7.5V, 10V; Current - Output: 10mA; Tolerance: ±0.1%; Temperature Coefficient: 15ppm/°C; Noise - 0.1Hz to 10Hz: 50µVp-p; Voltage - Input: 4.5 V ~ 30 V; Current - Supply: 1mA; Supplier 1: Digi-Key; Supplier Part Number 1: AD584KH-ND; Manufacturer Part Number 1: AD584KH; RoHS 1: RoHS non-compliant; Description 1: IC VREF SERIES PROG TO99-8; Stock 1: 133; Pricing 1: 1=30.28, 10=27.928, 100=23.8488 (USD); Packaging: Bulk; Part Status: Active; Reference Type: Series; Voltage - Output (Max): -; Noise - 10Hz to 10kHz: -; Current - Cathode: -; Operating Temperature: 0°C ~ 70°C (TA); Mounting Type: Through Hole; Package / Case: TO-99-8 Metal Can; Supplier Device Package: TO-99-8; ComponentLink1URL: http://www.analog.com/media/en/technical-documentation/data-sheets/AD584.pdf; ComponentLink1Description: http://www.analog.com/media/en/technical-documentation/data-sheets/AD584.pdf